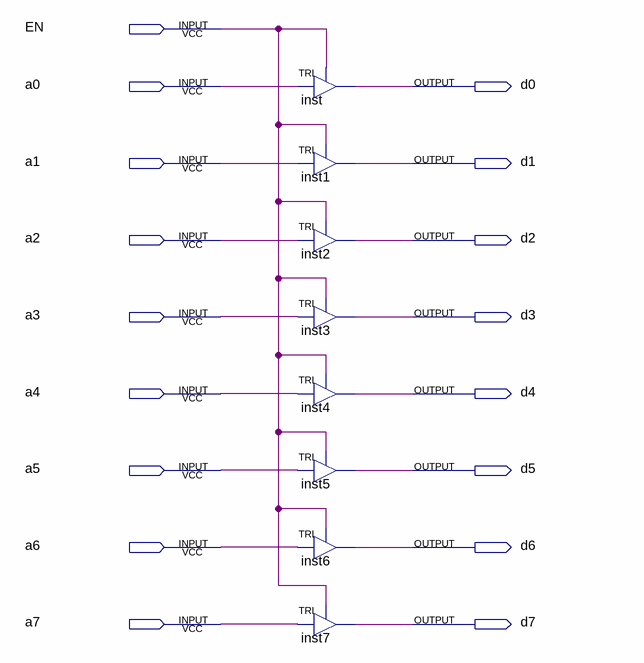
[diagram p0: schematic sheet]
// Quartus schematic EN.bdf as structural Verilog: 8 symbols, 17 pins
module EN (
  input  EN,
  input  a0,
  input  a1,
  input  a2,
  input  a3,
  input  a4,
  input  a5,
  input  a6,
  input  a7,
  output d0,
  output d1,
  output d2,
  output d3,
  output d4,
  output d5,
  output d6,
  output d7
);

  TRI inst (.IN(a0), .OE(EN), .OUT(d0));
  TRI inst1 (.IN(a1), .OE(EN), .OUT(d1));
  TRI inst2 (.IN(a2), .OE(EN), .OUT(d2));
  TRI inst3 (.IN(a3), .OE(EN), .OUT(d3));
  TRI inst4 (.IN(a4), .OE(EN), .OUT(d4));
  TRI inst5 (.IN(a5), .OE(EN), .OUT(d5));
  TRI inst6 (.IN(a6), .OE(EN), .OUT(d6));
  TRI inst7 (.IN(a7), .OE(EN), .OUT(d7));
endmodule
